# Altium schematic sheet VIDEO_OUT_SVGA.SchDoc: SVGA Video Output
size A4
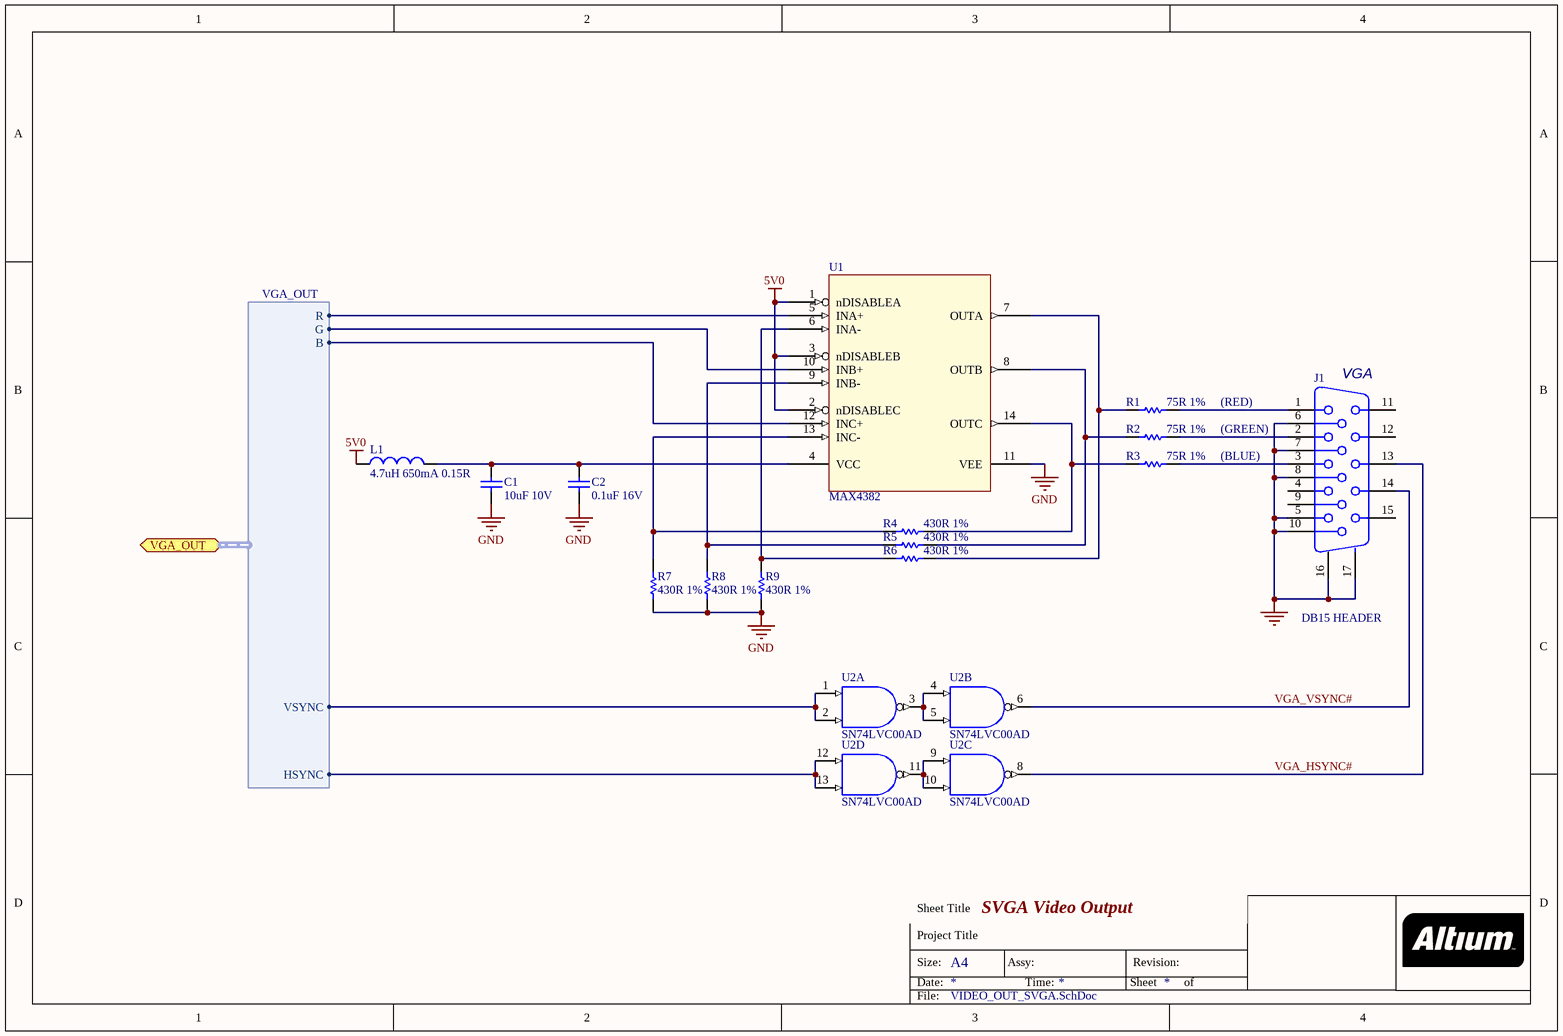
[diagram p0: VIDEO_OUT_SVGA.SchDoc]

## Parts
C1  10uF 10V  [CAPC2012-STAR]
C2  0.1uF 16V  [CAPC1005-STAR]
J1  DB15 HEADER  [DB15-VGA-Female]
L1  4.7uH 650mA 0.15R  [INDC3225]
R1  75R 1%  [RESC1005-STAR]
R2  75R 1%  [RESC1005-STAR]
R3  75R 1%  [RESC1005-STAR]
R4  430R 1%  [RESC1005-STAR]
R5  430R 1%  [RESC1005-STAR]
R6  430R 1%  [RESC1005-STAR]
R7  430R 1%  [RESC1005-STAR]
R8  430R 1%  [RESC1005-STAR]
R9  430R 1%  [RESC1005-STAR]
U1  MAX4382  [TSSOP-14]
U2  SN74LVC00AD  [SOIC127P600-14]  (parts A,B,C,D of 4)

## Ports
VGA_OUT (harness VGA_OUT)

## Harnesses
VGA_OUT: R, G, B, VSYNC, HSYNC

## Nets
3V3: U2.14(VDD)
5V0: L1.2 U1.1(nDISABLEA) U1.2(nDISABLEC) U1.3(nDISABLEB)
GND: C1.1 C2.2 J1.5 J1.6 J1.7 J1.8 J1.10 J1.16(MH1) J1.17(MH2) R7.1 R8.1 R9.1 U1.11(VEE) U2.7(GND)
VGA_HSYNC#: J1.13 U2.8(Y)
VGA_VSYNC#: J1.14 U2.6(Y)
NetC1_2: C1.2 C2.1 L1.1 U1.4(VCC)
NetJ1_1: J1.1 R1.2
NetJ1_2: J1.2 R2.2
NetJ1_3: J1.3 R3.2
NetR1_1: R1.1 R6.2 U1.7(OUTA)
NetR2_1: R2.1 R5.2 U1.8(OUTB)
NetR3_1: R3.1 R4.2 U1.14(OUTC)
NetR4_1: R4.1 R7.2 U1.13(INC-)
NetR5_1: R5.1 R8.2 U1.9(INB-)
NetR6_1: R6.1 R9.2 U1.6(INA-)
NetU1_5: U1.5(INA+) ; port VGA_OUT.R
NetU1_10: U1.10(INB+) ; port VGA_OUT.G
NetU1_12: U1.12(INC+) ; port VGA_OUT.B
NetU2_1: U2.1(A) U2.2(B) ; port VGA_OUT.VSYNC
NetU2_3: U2.3(Y) U2.4(A) U2.5(B)
NetU2_9: U2.9(A) U2.10(B) U2.11(Y)
NetU2_12: U2.12(A) U2.13(B) ; port VGA_OUT.HSYNC

Not connected (* = marked no-connect by the designer): J1 4 9 11 12 15

## Notes on the sheet
- (near J1) VGA
- (RED)
- (GREEN)
- (BLUE)
- Sheet Title
- Project Title
- Size:
- Date:
- A4
- Assy:
- Time:
- Sheet
- Revision:
- of
- File:

## Library data of the parts
C1 = D-101-0087: Capacitor, Ceramic, 10uF 10% 10V 0805 (2012) X5R; Polarity: Non-Polarized; Capacitance: 10 uF; Category: Capacitor; Dielectric: X5R; Mounting Technology: Surface Mount; Rated Voltage: 10 V; Status: Unreleased; Technology: None; Tolerance: 10 %
C2 = D-101-0080: Capacitor, Ceramic, 0.1uF 10% 16V 0402 (1005) X7R; Polarity: Non-Polarized; Capacitance: 0.1 uF; Category: Capacitor; Dielectric: X7R; Mounting Technology: Surface Mount; Rated Voltage: 16 V; Status: Production; Technology: Ceramic; Tolerance: 10 %
J1 = D-300-0049: Connector, DB15 Right-Angle Female (Analog RGB Video)/Blue; Max Current: mA; Category: Connector; Connector type: Header; Mounting Technology: Through-Hole; Status: Production
L1 = D-102-0005: Inductor, 4.7uH 650mA 0.15R 1210 (3225) LQH32CN4R7M11L; Category: Inductor; Status: Production
R1-R3 = D-100-0001: Resistor, 75R 1% 0402; Power Rating: mW; Resistance: mR; Category: Resistor; Mounting Technology: Surface Mount; Status: Production; Tolerance: 1 %
R4-R9 = D-100-0096: Resistor, 430R 1% 0402 (1005); Power Rating: 63 mW; Category: Resistor; Mounting Technology: Surface Mount; Resistance: 430 R; Status: Production; Tolerance: 1 %
U1 = D-203-0002: MAX4382 OPAMP, TSSOP14; Status: Unreleased; Temperature Range: -40 to +85 deg C; Category: IC-Opamp
U2 = D-205-0002: SN74LVC00AD, Quad 2-Input Positive-Nand Gates, 1.65-3.6V, 5V Tolerant Inputs; Status: Production; Category: IC-Logic